# Altium schematic sheet Motherboard Connection.SchDoc
size A3; SheetNumber: 4; SheetTotal: 5
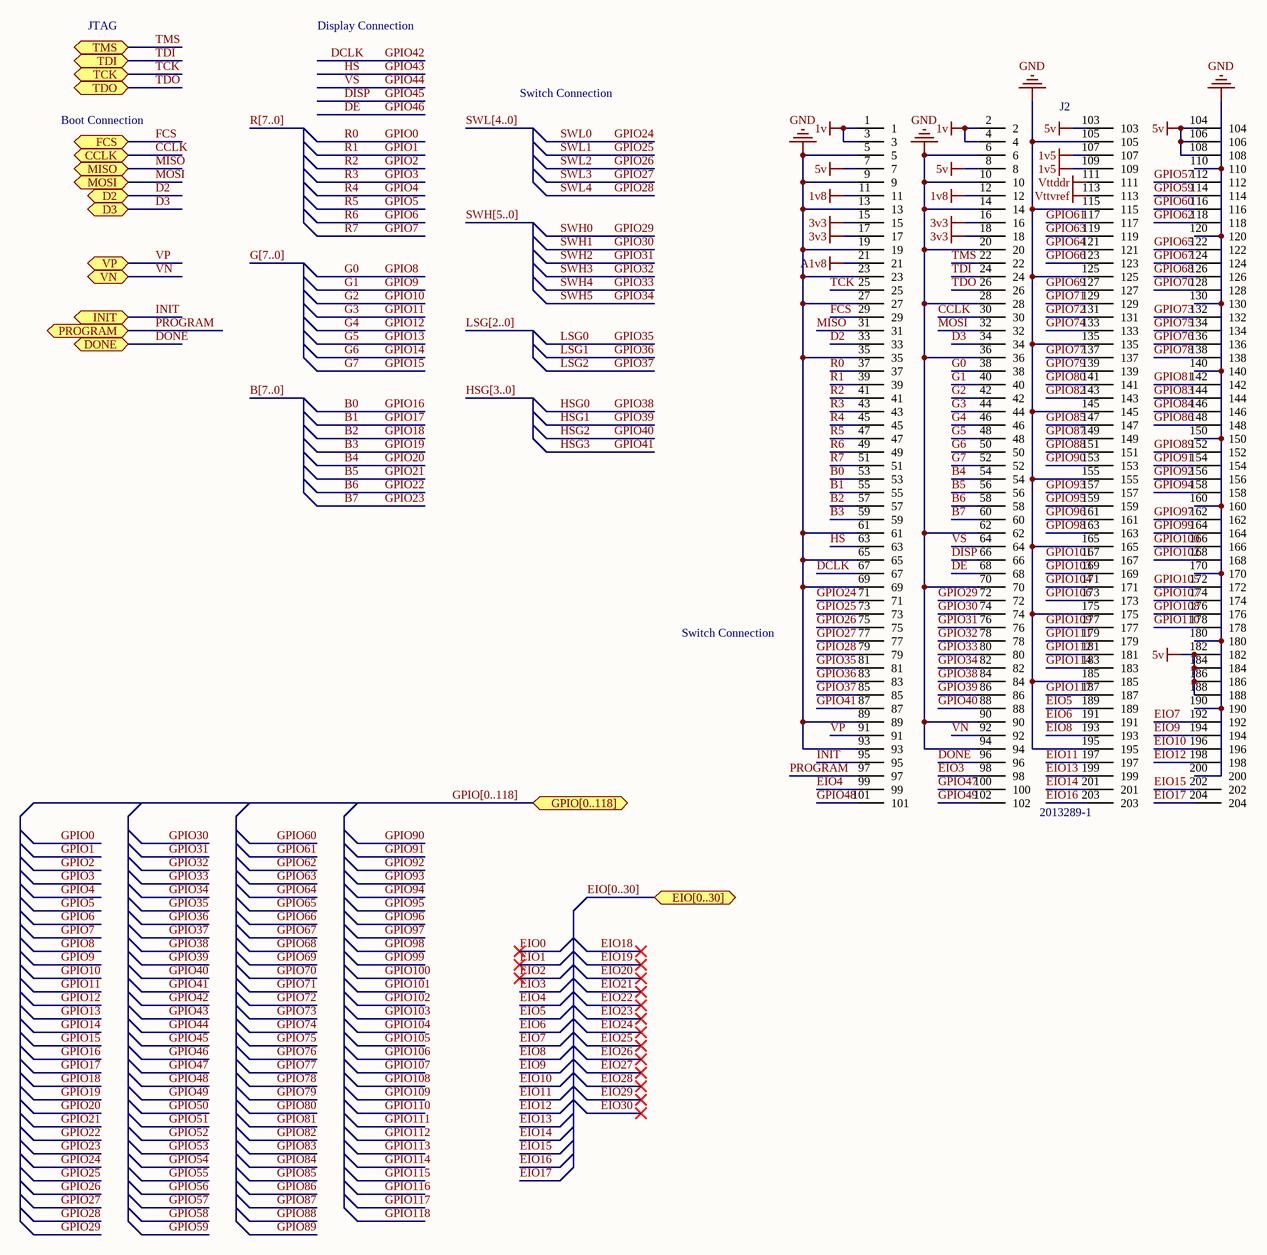
[diagram p0: Motherboard Connection.SchDoc]

## Parts
J2  2013289-1  [DDR3 SODIMM Gold Finger]

## Ports
CCLK (bidir), D2 (bidir), D3 (bidir), DONE (bidir), EIO[0..30] (bidir), FCS (bidir), GPIO[0..118] (bidir), INIT (bidir), MISO (bidir), MOSI (bidir), PROGRAM (bidir), TCK (bidir), TDI (bidir), TDO (bidir), TMS (bidir), VN (bidir), VP (bidir)

## Nets
1v: J2.1 J2.2 J2.3 J2.4
1v5: J2.107 J2.109
1v8: J2.11 J2.12
3v3: J2.15 J2.16 J2.17 J2.18
5v: J2.7 J2.8 J2.103 J2.104 J2.106 J2.108 J2.182 J2.184 J2.186 J2.188
A1v8: J2.21
GND: J2.5 J2.6 J2.9 J2.10 J2.13 J2.14 J2.19 J2.20 J2.23 J2.27 J2.28 J2.35 J2.36 J2.61 J2.62 J2.65 J2.69 J2.70 J2.89 J2.90 J2.93 J2.94 J2.105 J2.110 J2.115 J2.120 J2.125 J2.130 J2.135 J2.140 J2.145 J2.150 J2.155 J2.160 J2.165 J2.170 J2.175 J2.180 J2.185 J2.190 J2.195 J2.200
Vttddr: J2.111
Vttvref: J2.113
B0: J2.53  [also labelled GPIO16]
B1: J2.55  [also labelled GPIO17]
B2: J2.57  [also labelled GPIO18]
B3: J2.59  [also labelled GPIO19]
B4: J2.54  [also labelled GPIO20]
B5: J2.56  [also labelled GPIO21]
B6: J2.58  [also labelled GPIO22]
B7: J2.60  [also labelled GPIO23]
CCLK: J2.30 ; port CCLK
D2: J2.33 ; port D2
D3: J2.34 ; port D3
DCLK: J2.67  [also labelled GPIO42]
DE: J2.68  [also labelled GPIO46]
DISP: J2.66  [also labelled GPIO45]
DONE: J2.96 ; port DONE
EIO3: J2.98
EIO4: J2.99
EIO5: J2.189
EIO6: J2.191
EIO7: J2.192
EIO8: J2.193
EIO9: J2.194
EIO10: J2.196
EIO11: J2.197
EIO12: J2.198
EIO13: J2.199
EIO14: J2.201
EIO15: J2.202
EIO16: J2.203
EIO17: J2.204
FCS: J2.29 ; port FCS
G0: J2.38  [also labelled GPIO8]
G1: J2.40  [also labelled GPIO9]
G2: J2.42  [also labelled GPIO10]
G3: J2.44  [also labelled GPIO11]
G4: J2.46  [also labelled GPIO12]
G5: J2.48  [also labelled GPIO13]
G6: J2.50  [also labelled GPIO14]
G7: J2.52  [also labelled GPIO15]
GPIO0: J2.37  [also labelled R0]
GPIO1: J2.39  [also labelled R1]
GPIO2: J2.41  [also labelled R2]
GPIO3: J2.43  [also labelled R3]
GPIO4: J2.45  [also labelled R4]
GPIO5: J2.47  [also labelled R5]
GPIO6: J2.49  [also labelled R6]
GPIO7: J2.51  [also labelled R7]
GPIO24: J2.71  [also labelled SWL0]
GPIO25: J2.73  [also labelled SWL1]
GPIO26: J2.75  [also labelled SWL2]
GPIO27: J2.77  [also labelled SWL3]
GPIO28: J2.79  [also labelled SWL4]
GPIO29: J2.72  [also labelled SWH0]
GPIO30: J2.74  [also labelled SWH1]
GPIO31: J2.76  [also labelled SWH2]
GPIO32: J2.78  [also labelled SWH3]
GPIO33: J2.80  [also labelled SWH4]
GPIO34: J2.82  [also labelled SWH5]
GPIO35: J2.81  [also labelled LSG0]
GPIO36: J2.83  [also labelled LSG1]
GPIO37: J2.85  [also labelled LSG2]
GPIO38: J2.84  [also labelled HSG0]
GPIO39: J2.86  [also labelled HSG1]
GPIO40: J2.88  [also labelled HSG2]
GPIO41: J2.87  [also labelled HSG3]
GPIO43: J2.63  [also labelled HS]
GPIO44: J2.64  [also labelled VS]
GPIO47: J2.100
GPIO48: J2.101
GPIO49: J2.102
GPIO57: J2.112
GPIO59: J2.114
GPIO60: J2.116
GPIO61: J2.117
GPIO62: J2.118
GPIO63: J2.119
GPIO64: J2.121
GPIO65: J2.122
GPIO66: J2.123
GPIO67: J2.124
GPIO68: J2.126
GPIO69: J2.127
GPIO70: J2.128
GPIO71: J2.129
GPIO72: J2.131
GPIO73: J2.132
GPIO74: J2.133
GPIO75: J2.134
GPIO76: J2.136
GPIO77: J2.137
GPIO78: J2.138
GPIO79: J2.139
GPIO80: J2.141
GPIO81: J2.142
GPIO82: J2.143
GPIO83: J2.144
GPIO84: J2.146
GPIO85: J2.147
GPIO86: J2.148
GPIO87: J2.149
GPIO88: J2.151
GPIO89: J2.152
GPIO90: J2.153
GPIO91: J2.154
GPIO92: J2.156
GPIO93: J2.157
GPIO94: J2.158
GPIO95: J2.159
GPIO96: J2.161
GPIO97: J2.162
GPIO98: J2.163
GPIO99: J2.164
GPIO100: J2.166
GPIO101: J2.167
GPIO102: J2.168
GPIO103: J2.169
GPIO104: J2.171
GPIO105: J2.172
GPIO106: J2.173
GPIO107: J2.174
GPIO108: J2.176
GPIO109: J2.177
GPIO110: J2.178
GPIO111: J2.179
GPIO112: J2.181
GPIO114: J2.183
GPIO117: J2.187
INIT: J2.95 ; port INIT
MISO: J2.31 ; port MISO
MOSI: J2.32 ; port MOSI
PROGRAM: J2.97 ; port PROGRAM
TCK: J2.25 ; port TCK
TDI: J2.24 ; port TDI
TDO: J2.26 ; port TDO
TMS: J2.22 ; port TMS
VN: J2.92 ; port VN
VP: J2.91 ; port VP

## Buses and harness runs
bus B[7..0]
bus EIO[0..30] = port EIO[0..30]
bus G[7..0]
bus GPIO[0..118] = port GPIO[0..118]
bus HSG[3..0]
bus LSG[2..0]
bus R[7..0]
bus SWH[5..0]
bus SWL[4..0]

## Notes on the sheet
- JTAG
- Display Connection
- Switch Connection
- Boot Connection

## Library data of the parts
J2 = 2013289-1: 204 Position 0.6 mm Pitch Right Angle Surface Mount Socket DIMM Connector; Number_of_Positions: 204; MF: TE Connectivity; Centerline_Pitch: .6 mm[.024 in]; Product_Type: Socket; Package: None; Digi-Key_Purchase_URL: https://www.digikey.com/product-detail/en/te-connectivity-amp-connectors/2013289-1/A115021-ND/2135546?utm_source=snapeda&utm_medium=aggregator&utm_campaign=symbol; Digi-Key_Part_Number: A115021-ND; SnapEDA_Link: https://www.snapeda.com/parts/2013289-1/TE%20Connectivity%20AMP%20Connectors/view-part/231016/?ref=snap; MP: 2013289-1; TE_purchase_URL: https://www.te.com/usa-en/product-2013289-1.html?te_bu=Cor&te_type=disp&te_campaign=seda_glo_cor-seda-global-disp-prtnr-fy19-seda-model-bom-cta_sma-317_1&elqCampaignId=32493; Value: *